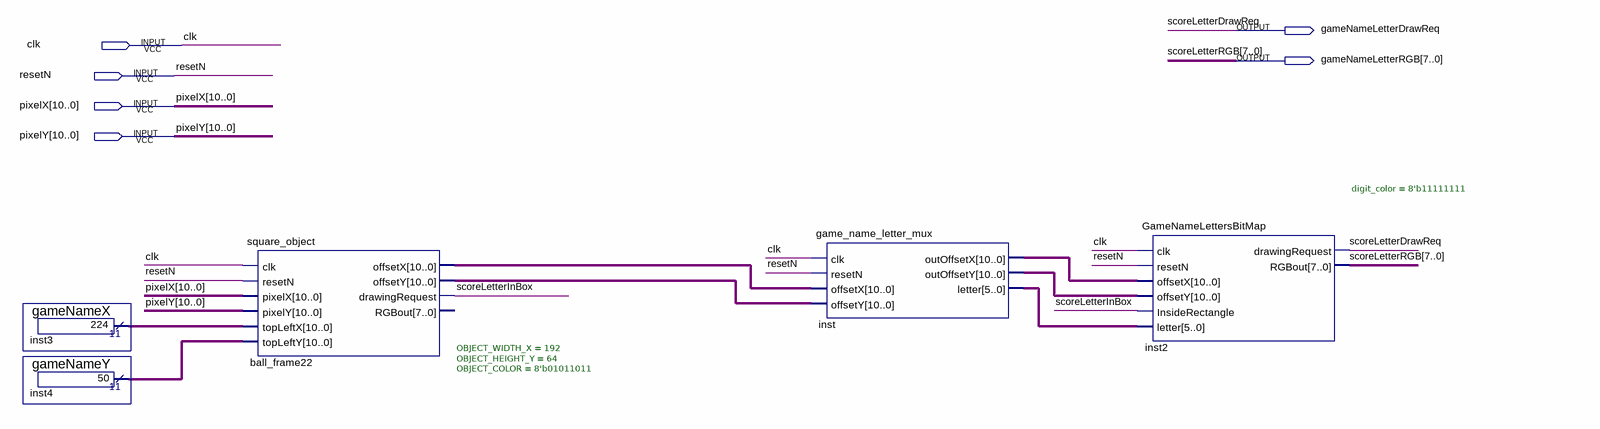
[diagram p0: schematic sheet]
// Quartus schematic gameName.bdf as structural Verilog: 5 symbols, 6 pins
module gameName (
  input  clk,
  input  resetN,
  input  [10:0] pixelX,
  input  [10:0] pixelY,
  output gameNameLetterDrawReq,
  output [7:0] gameNameLetterRGB
);

  wire scoreLetterInBox;
  wire [5:0] inst_letter;
  wire [10:0] ball_frame22_offsetx, ball_frame22_offsety, inst3_result, inst4_result, inst_outoffsetx,
       inst_outoffsety;

  gameNameX inst3 (.result(inst3_result));
  gameNameY inst4 (.result(inst4_result));
  square_object #(.OBJECT_WIDTH_X(192), .OBJECT_HEIGHT_Y(64), .OBJECT_COLOR(8'b01011011)) ball_frame22 (
    .clk(clk), .resetN(resetN), .pixelX(pixelX), .pixelY(pixelY), .topLeftX(inst3_result),
    .topLeftY(inst4_result), .offsetX(ball_frame22_offsetx), .offsetY(ball_frame22_offsety),
    .drawingRequest(scoreLetterInBox));  // open: RGBout
  game_name_letter_mux inst (
    .clk(clk), .resetN(resetN), .offsetX(ball_frame22_offsetx), .offsetY(ball_frame22_offsety),
    .outOffsetX(inst_outoffsetx), .outOffsetY(inst_outoffsety), .letter(inst_letter));
  GameNameLettersBitMap #(.digit_color(8'b11111111)) inst2 (
    .clk(clk), .resetN(resetN), .offsetX(inst_outoffsetx), .offsetY(inst_outoffsety),
    .InsideRectangle(scoreLetterInBox), .letter(inst_letter), .drawingRequest(gameNameLetterDrawReq),
    .RGBout(gameNameLetterRGB));

  // Other names for the same wires on the sheet: scoreLetterDrawReq = gameNameLetterDrawReq;
  //   scoreLetterRGB[7:0] = gameNameLetterRGB
endmodule
